# EAGLE design weaver_pot (EAGLE 7.4.0)
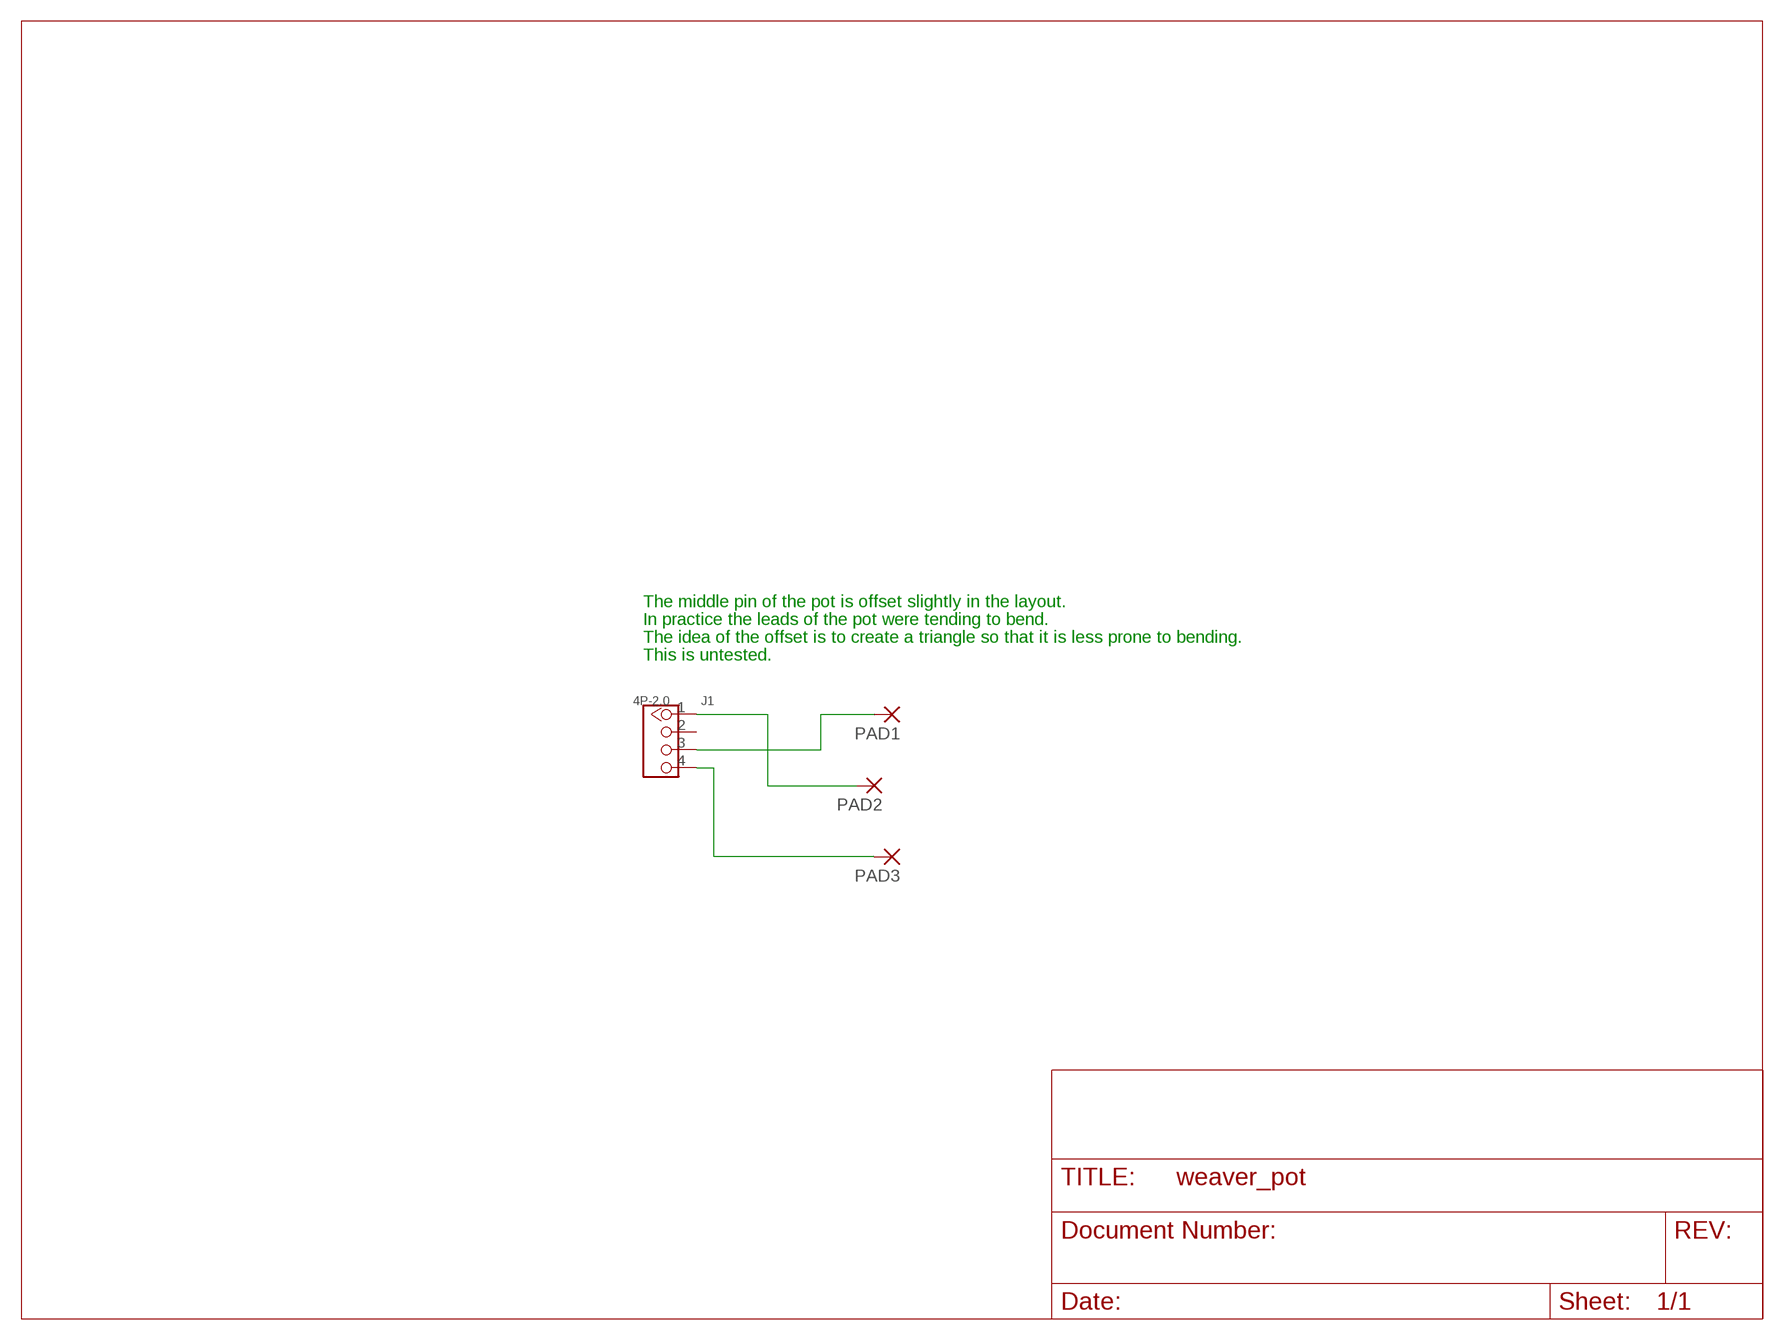
[diagram p0: schematic, sheet 1]

## Parts
J1  4P-2.0  GROVE-CONNECTOR-DIP(4P-2.0)  [HW4-2.0]
PAD1  3,81/1,1  [3,81/1,1]
PAD2  3,81/1,1  [3,81/1,1]
PAD3  3,81/1,1  [3,81/1,1]

## Nets
N$1: J1.4 PAD3.1(P)
N$2: J1.3 PAD1.1(P)
N$3: J1.1 PAD2.1(P)
Unconnected: J1.2

## Notes on the sheet
- The middle pin of the pot is offset slightly in the layout.
- In practice the leads of the pot were tending to bend.
- The idea of the offset is to create a triangle so that it is less prone to bending.
- This is untested.

## Library data of the parts
J1 = NanoPlaygroundFace:GROVE-CONNECTOR-DIP(4P-2.0): 320110033
PAD1-PAD3 = wirepad:3,81/1,1: THROUGH-HOLE PAD

## Net classes
0 default: width 0.305 mm, drill 0.508 mm, clearance 0.254 mm

## Board
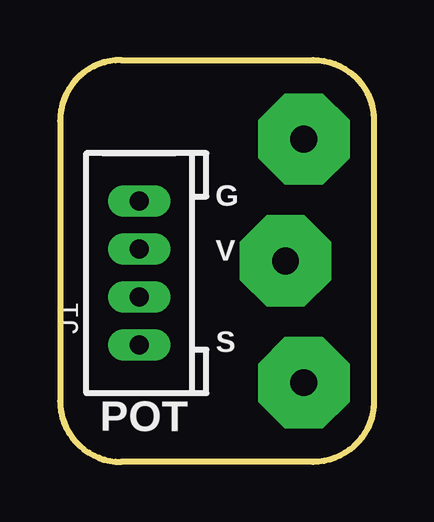
[diagram p1: board, top side]
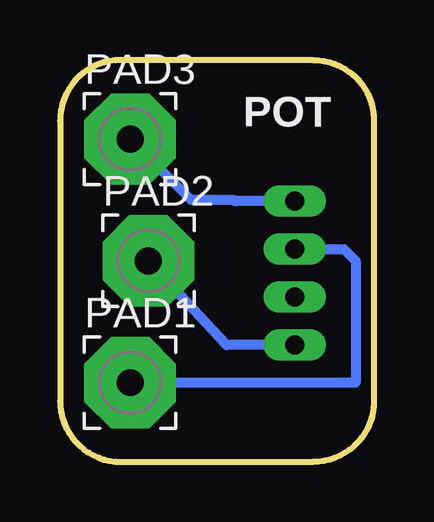
[diagram p2: board, bottom side, seen from below]

Size 13.08 x 16.76 mm. Coordinates in mm from the lower left corner, seen from the top.
Outline: 0,14.22 0,2.54 arc90 2.54,0 10.54,0 arc90 13.08,2.54 13.08,14.22 arc90 10.54,16.76 2.54,16.76 arc90 0,14.22
Copper layers (1*16): Top 0.035mm / dielectric 1.5mm / Bottom 0.035mm
Design rules "default *": minimum track width 10mil, minimum drill 20mil, track to track 8mil, track to pad 8mil, pad to pad 8mil, via to via 8mil, smd to smd 8mil, copper to edge 40mil, drill to drill 8mil, minimum pad ring 10mil, minimum via ring 8mil, stop-mask expansion 4mil, vias tented up to drill 0mil, thermal gap 10mil

### Footprints (pad centres in the part's own frame; a part is rotated, then mirrored left to right if it is on the bottom)
HW4-2.0 = drill 0.8 pad 1.27 long: 1 -3,0; 2 -1,0; 3 1,0; 4 3,0
3,81/1,1 = drill 1.118 pad 3.81 octagon: 1 0,0

### Placement (x,y rotation side)
J1  3.3,7.87 90 top
PAD1  10.16,3.3 0 bottom
PAD2  9.4,8.38 0 bottom
PAD3  10.16,13.46 0 bottom

### Tracks (layer width: path | path; a pad name or v marks a point on that pad's centre or on a via)
N$1
  Bottom 0.406: J1.4 5.79,10.87 5.84,10.92 7.62,10.92 PAD3.1
N$2
  Bottom 0.406: J1.3 1.25,8.87 0.76,8.38 0.76,3.3 PAD1.1
N$3
  Bottom 0.406: J1.1 6.14,4.87 PAD2.1

### Text on the board
tPlace: G | V | S | POT
bPlace: POT